# EasyEDA Pro project PicoMiteUSB.eprj, board PCB3
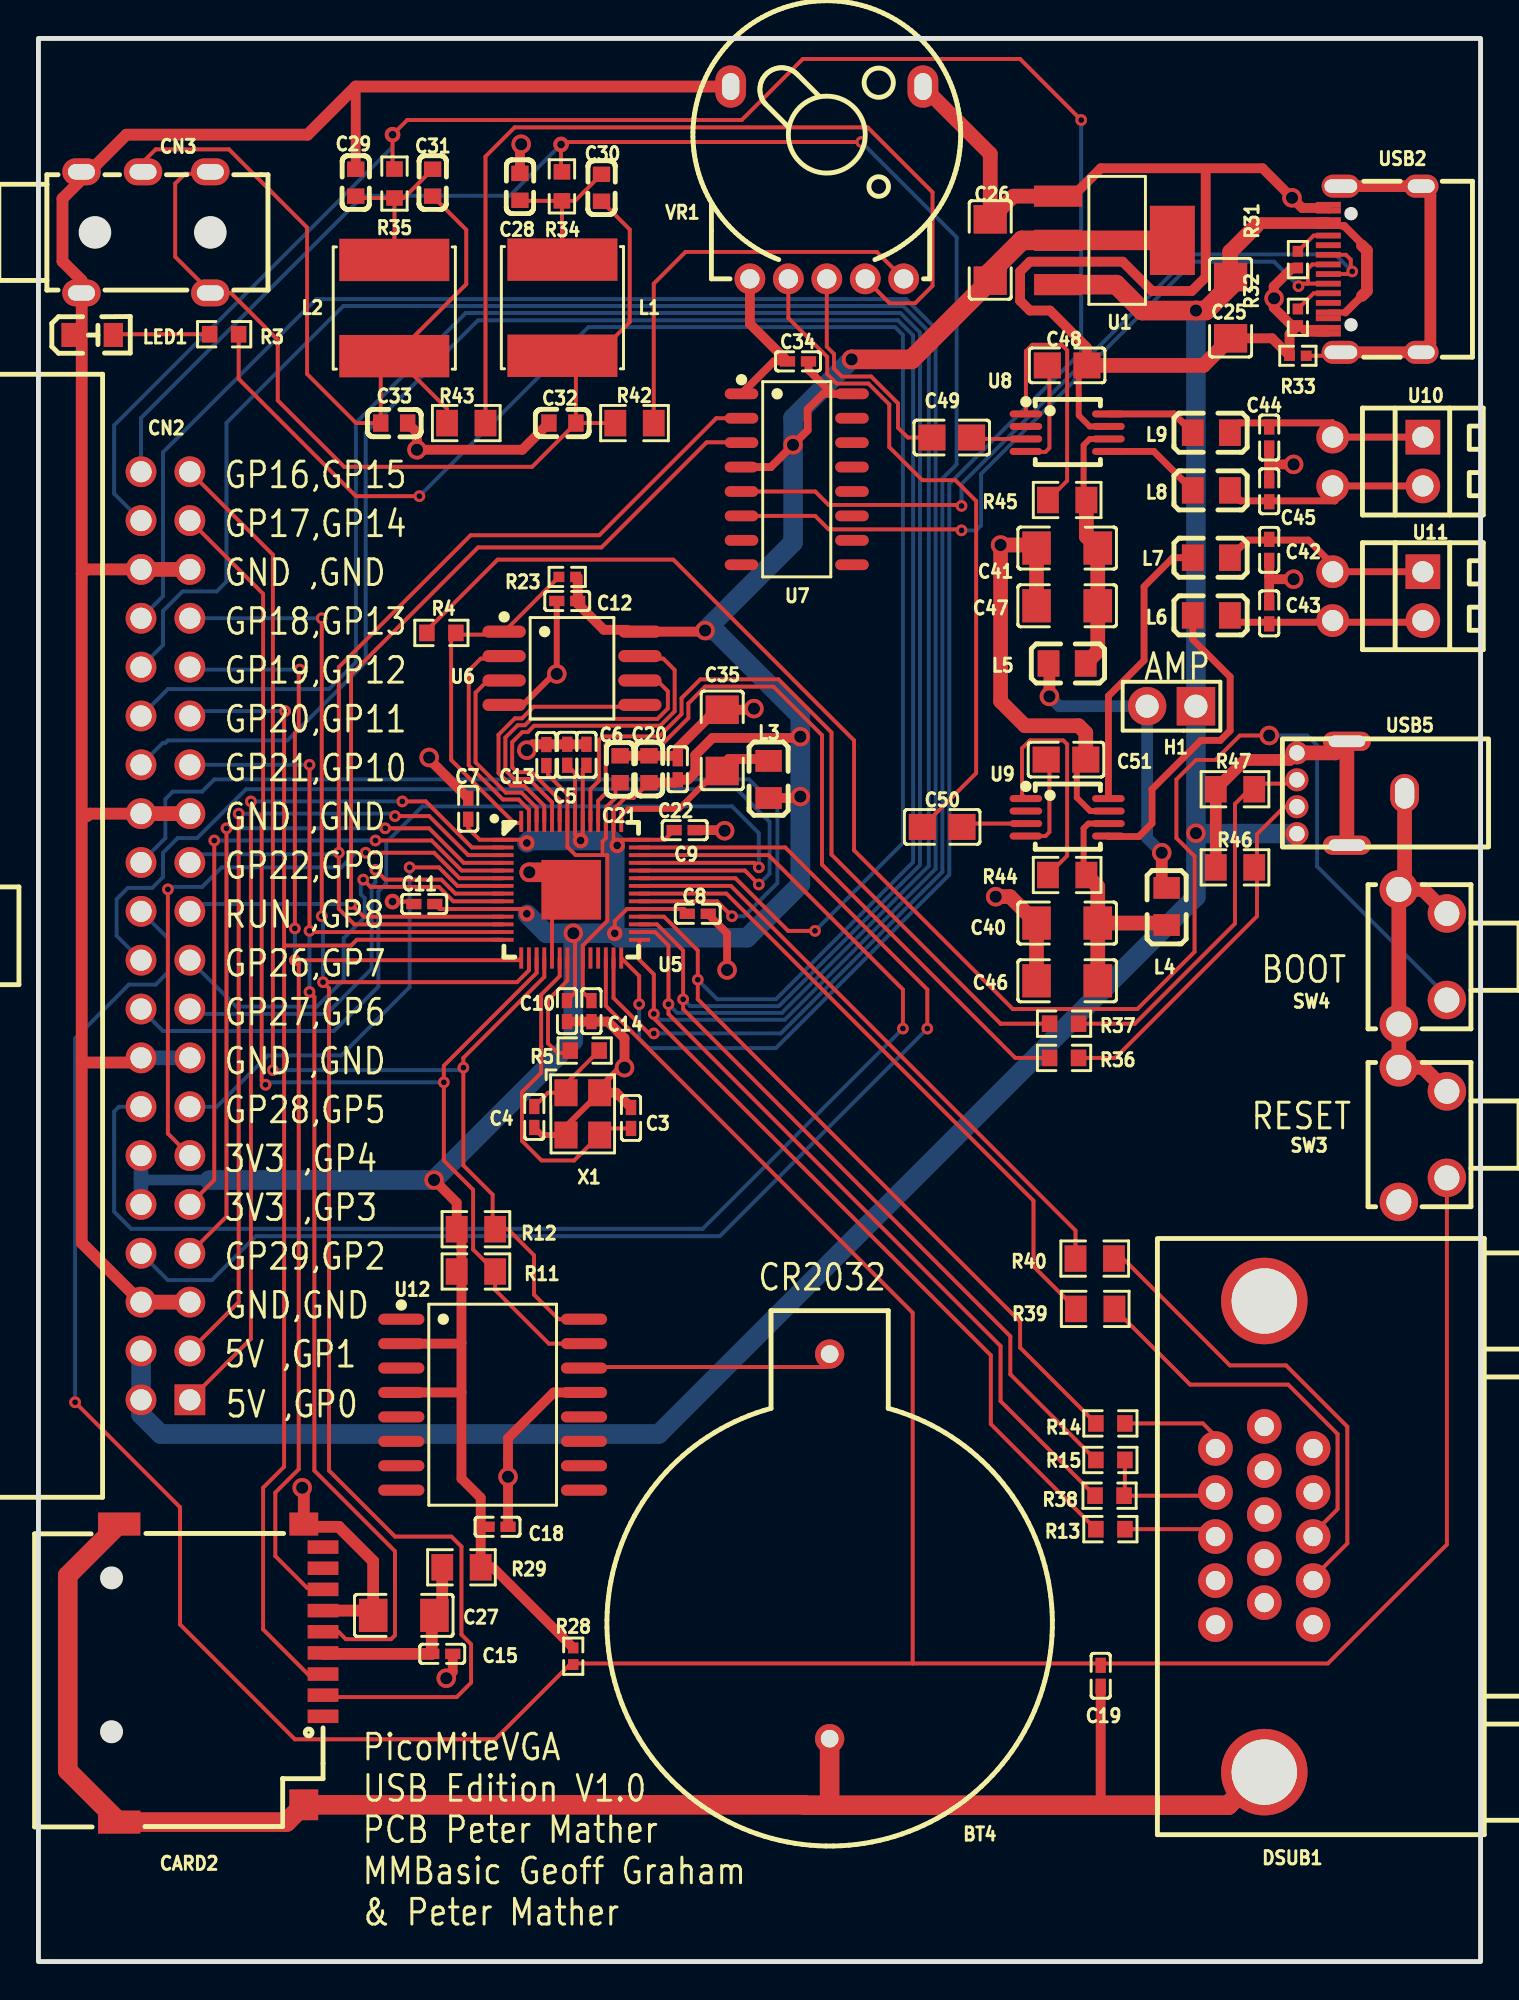
[diagram p1: board, top side]
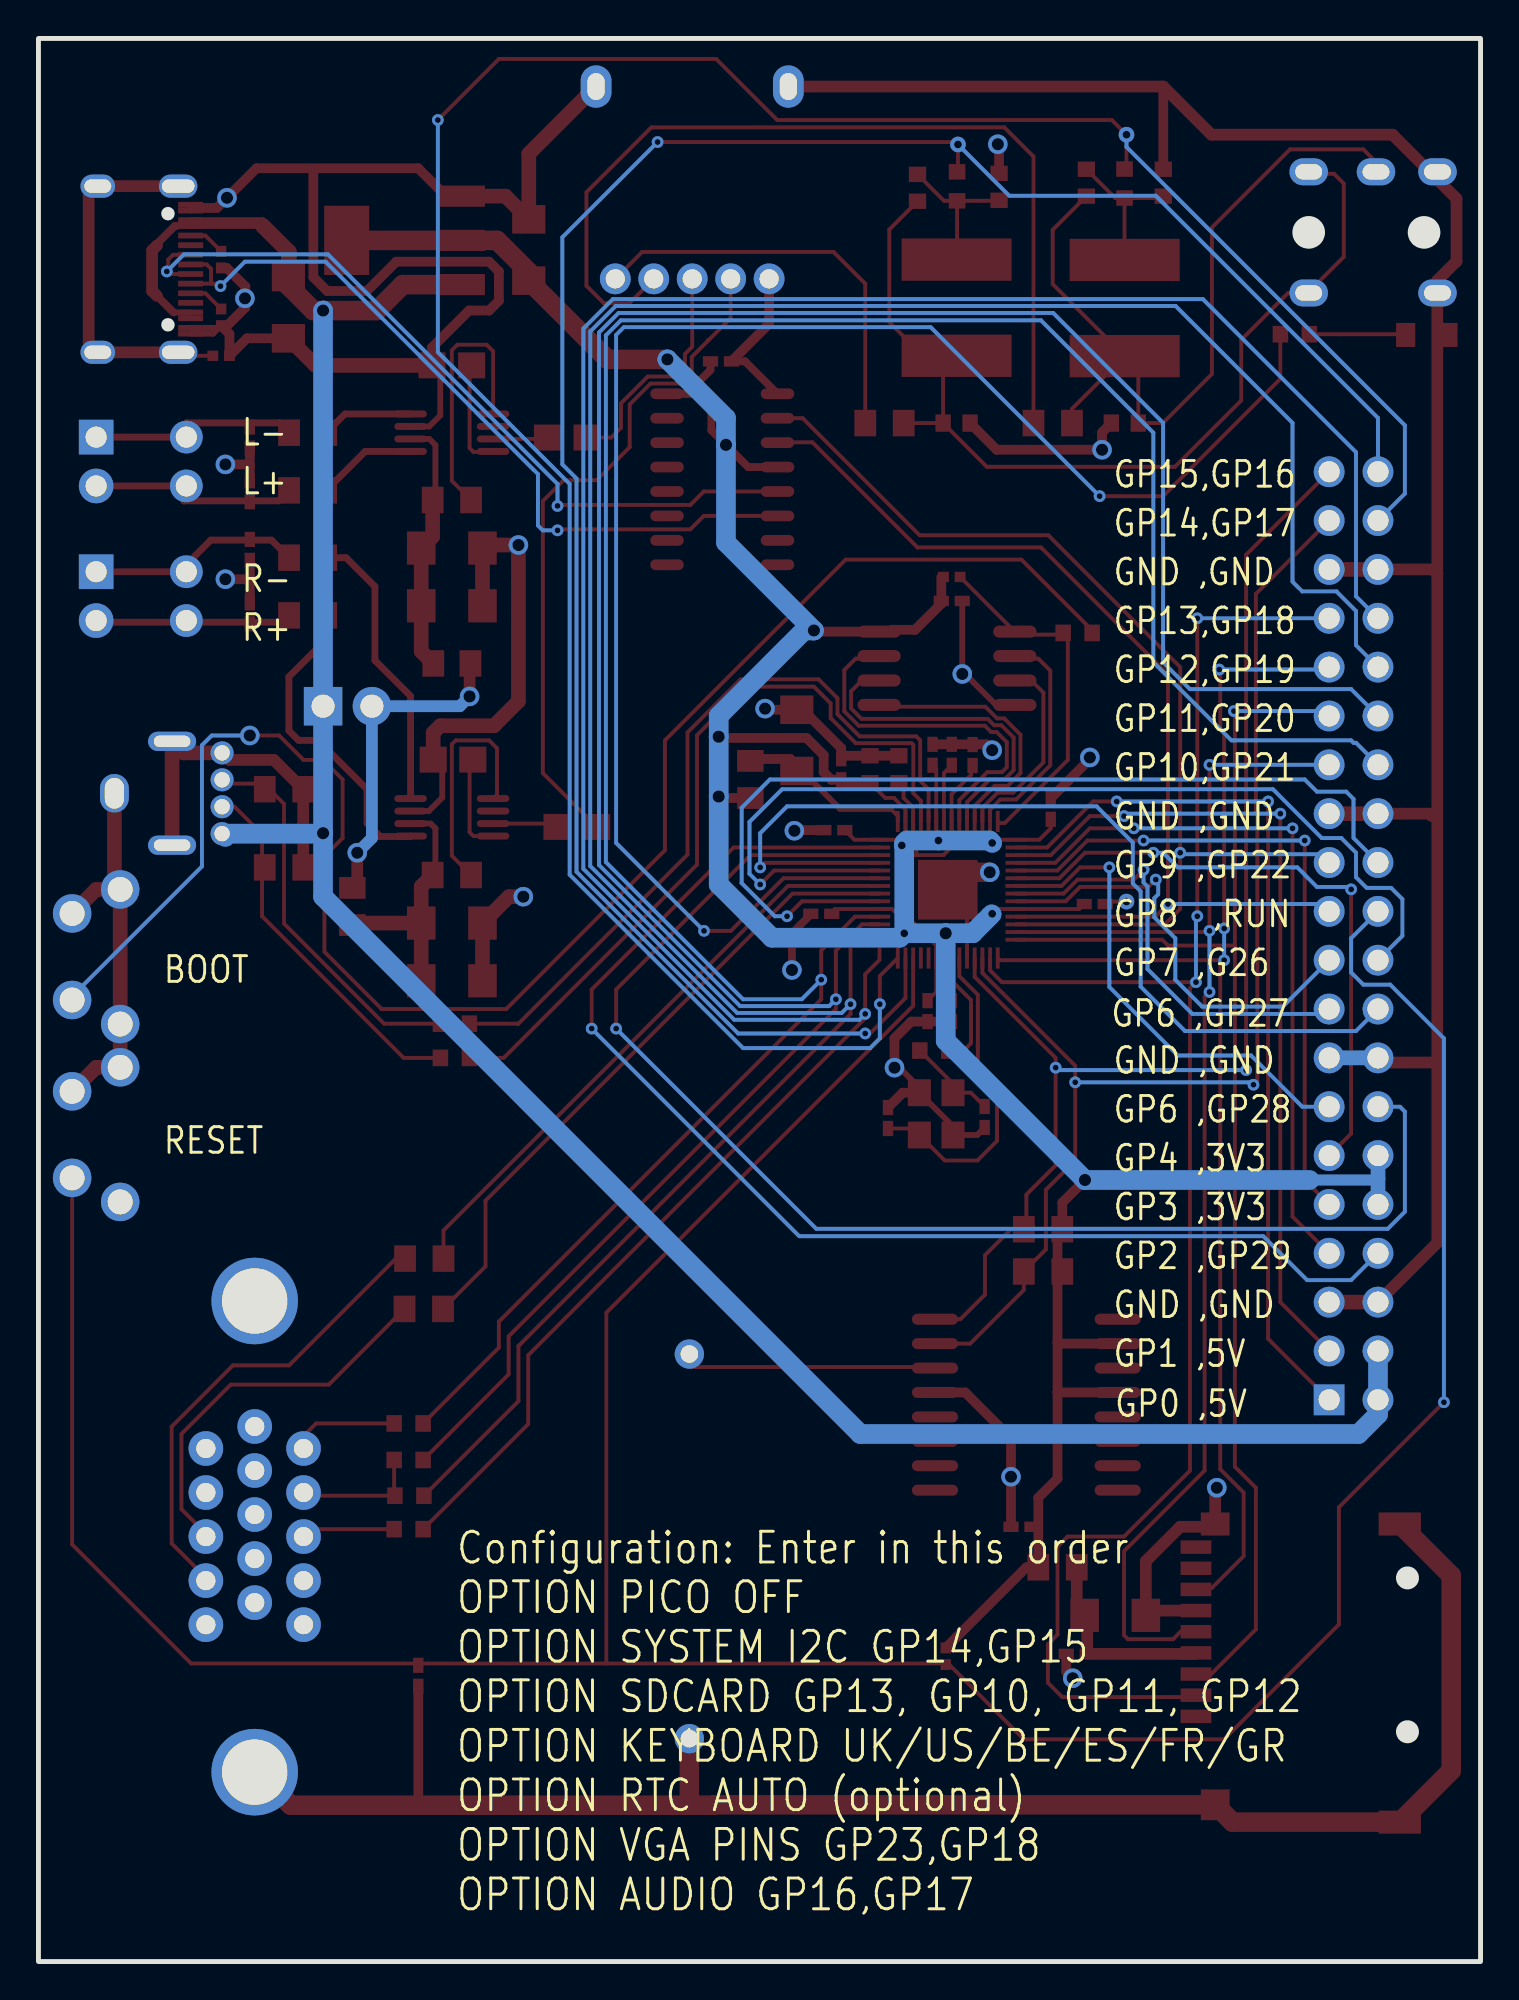
[diagram p2: board, bottom side, seen from below]

Outline 75 x 100 mm; copper layers: Top Layer, Bottom Layer. Coordinates in mm from the lower left corner of the outline.
Outline path: rectangle 75,0 0,100
Stack: Top Layer 0.035mm / Dielectric1 1.51mm FR4 er 4.5 / Bottom Layer 0.035mm

## Design rules (mm)
spacing safeClearance (default): track to track 0.152, other pairs 0.152 to 0.3
track width trackWidth (default): min 0.127, default 0.254, max 2.54
differential pair differentialPair (default): width min 0.127, default 0.254, max 2.54; gap min 0.152, default 0.152
via viaSize (default): diameter min 0.5, default 0.61, max 10; hole min 0.3, default 0.305, max 6

## Placement (name value [footprint] x y rotation side)
BT4  BS-04-A1BJ005  [BAT-TH_BS-04-A1BJ004]  41.15 21.59 90 top
C3  30pF  [C0402]  30.82 43.87 270 top
C4  30pF  [C0402]  25.79 43.92 90 top
C5  100nF  [C0402_NEW]  27.5 62.75 270 top
C6  100nF  [C0402_NEW]  28.5 62.75 270 top
C7  100nF  [C0402_NEW]  22.35 59.94 270 top
C8  100nF  [C0402_NEW]  34.29 54.48 180 top
C9  100nF  [C0402_NEW]  33.61 58.83 180 top
C10  100nF  [C0402_NEW]  27.49 49.42 90 top
C11  100nF  [C0402_NEW]  20.07 54.99 0 top
C12  100nF  [C0402_NEW]  27.5 70.75 0 top
C13  100nF  [C0402_NEW]  26.42 62.74 90 top
C14  100nF  [C0402_NEW]  28.76 49.42 270 top
C15  100nF  [C0402_NEW]  21 16 0 top
C18  100nF  [C0402_NEW]  23.88 22.61 180 top
C19  100nF  [C0402_NEW]  55.25 14.86 90 top
C20  2.2uF  [C0603]  31.75 62 270 top
C21  2.2uF  [C0603]  30.25 62 90 top
C22  100nF  [C0402_NEW]  33.25 62 270 top
C25  10uF  [C1206]  62 86 90 top
C26  10uF  [C1206]  49.5 89 270 top
C27  10uF  [C1206]  19 18 180 top
C28  33nF  [C0603]  25.04 92.28 270 top
C29  33nF  [C0603]  16.5 92.5 270 top
C30  2.7nF  [C0603]  29.28 92.23 270 top
C31  2.7nF  [C0603]  20.5 92.5 270 top
C32  68nF  [C0603]  27.25 80 0 top
C33  68nF  [C0603]  18.5 80 180 top
C34  100nF  [C0402_NEW]  39.5 83.21 180 top
C35  10uF  [C1206]  35.56 63.5 270 top
C40  10uF  [C1206]  53.5 54 180 top
C41  10uF  [C1206]  53.5 73.5 180 top
C42  220pF  [C0402]  64.01 73.41 90 top
C43  220pF  [C0402]  64.01 70.1 270 top
C44  220pF  [C0402]  64.01 79.25 90 top
C45  220pF  [C0402]  64.01 76.45 270 top
C46  1uF  [C1206]  53.5 51 0 top
C47  1uF  [C1206]  53.5 70.5 0 top
C48  100nF  [C0805]  53.5 83 180 top
C49  100nF  [C0805]  47.5 79.25 0 top
C50  100nF  [C0805]  47 59 0 top
C51  100nF  [C0805]  53.44 62.5 180 top
CARD2  TF PUSH  [TF-SMD_TF-PUSH]  9.5 15 270 top
CN2  X9555WR-2x20-6TV01  [CONN-TH_X9555WR-2X20-6TV01]  6.6 53.34 270 top
CN3  PJ-313 5JCJ  [AUDIO-TH_PJ-313_5JCJ]  5.59 89.92 0 top
DSUB1  D-DMRH15PF-E006  [DSUB-TH_15P-P2.29-H-F_DDMRH15PFE006]  63.75 22.1 90 top
H1  PZ254V-11-02P  [HDR-TH_2P-P2.54-V-M]  58.93 65.28 180 top
L1  4.7mH  [IND-SMD_L6.0-W6.0]  27.25 86 270 top
L2  4.7mH  [IND-SMD_L6.0-W6.0]  18.51 85.98 270 top
L3  BLM21AG102SN1D  [L0805]  37.97 61.47 270 top
L4  BLM21AG102SN1D  [L0805]  58.67 54.86 90 top
L5  BLM21AG102SN1D  [L0805]  53.5 67.5 180 top
L6  BLM21AG102SN1D  [L0805]  61 70 0 top
L7  BLM21AG102SN1D  [L0805]  61 73 0 top
L8  BLM21AG102SN1D  [L0805]  61 76.5 0 top
L9  BLM21AG102SN1D  [L0805]  61 79.5 0 top
LED1  NCD0805R1  [LED0805-RD]  2.79 84.58 0 top
NOREF  -  [Pad_e923]  67.31 72.27 0 top
NOREF#2  -  [Pad_e915]  67.31 76.73 0 top
NOREF#3  -  [Pad_e919]  67.31 69.73 0 top
NOREF#4  -  [Pad_e908]  67.31 79.27 0 top
R3  1kΩ  [R0603]  9.66 84.62 180 top
R4  1kΩ  [R0603]  20.96 69.09 180 top
R5  1kΩ  [R0603]  28.41 47.37 180 top
R11  10kΩ  [R0805]  22.75 35.88 180 top
R12  10kΩ  [R0805]  22.75 38.08 180 top
R13  270Ω  [R0603]  55.75 22.48 0 top
R14  270Ω  [R0603]  55.75 27.98 0 top
R15  390Ω  [R0603]  55.75 26.08 0 top
R23  10kΩ  [R0402]  27.5 72 0 top
R28  10kΩ  [R0402]  27.81 15.88 90 top
R29  2.2Ω  [R0805]  22 20.5 180 top
R31  5.1kΩ  [R0402]  65.5 88.5 90 top
R32  5.1kΩ  [R0402]  65.5 85.5 90 top
R33  1MΩ  [R0402]  65.5 83.5 0 top
R34  220Ω  [R0603]  27.22 92.31 270 top
R35  220Ω  [R0603]  18.52 92.46 270 top
R36  27Ω  [R0603]  53.34 46.99 180 top
R37  27Ω  [R0603]  53.34 48.77 180 top
R38  820Ω  [R0603]  55.71 24.22 0 top
R39  47Ω  [R0805]  54.96 33.94 0 top
R40  47Ω  [R0805]  54.93 36.55 0 top
R42  27kΩ  [R0805]  31 80 0 top
R43  27kΩ  [R0805]  22.25 80 0 top
R44  10kΩ  [R0805]  53.5 56.5 0 top
R45  10kΩ  [R0805]  53.5 76 0 top
R46  15kΩ  [R0805]  62.23 56.9 180 top
R47  15kΩ  [R0805]  62.23 60.96 180 top
SW3  TS665ZJ  [SW-TH_TS665ZJ]  72 43 90 top
SW4  TS665ZJ  [SW-TH_TS665ZJ]  72 52.25 90 top
U1  AMS1117-3.3  [SOT-223-3_L6.5-W3.4-P2.30-LS7.0-BR]  56 89.5 180 top
U5  RP2040  [LQFN-56_L7.0-W7.0-P0.4-EP]  27.71 55.73 0 top
U6  W25Q128JVSIQ  [SOIC-8_L5.3-W5.3-P1.27-LS8.0-BL]  27.75 67.25 270 top
U7  CH340C  [SOP-16_L10.0-W3.9-P1.27-LS6.0-BL]  39.44 77.08 270 top
U8  PAM8302AASCR  [MSOP-8_L3.0-W3.0-P0.65-LS5.0-BL]  53.5 79.5 270 top
U9  PAM8302AASCR  [MSOP-8_L3.0-W3.0-P0.65-LS5.0-BL]  53.5 59.5 270 top
U10  DB125-2.54-2P-GN-S  [CONN-TH_DB125-2.54-2P-GN]  72 78 270 top
U11  DB125-2.54-2P-GN-S  [CONN-TH_DB125-2.54-2P-GN]  72 71 270 top
U12  DS3231SN#T&amp;R  [SOIC-16_L10.3-W7.5-P1.27-LS10.3-BL]  23.62 28.96 270 top
USB2  KH-TYPE-C-16P  [USB-C-SMD_KH-TYPE-C-16P]  69.5 88 90 top
USB5  906-561A1024D10200  [USB-A-TH_C39450]  68.25 60.75 90 top
VR1  10kΩ  [RES-TH_RK10J12E002L]  41 92.5 0 top
X1  12MHz  [OSC-SMD_4P-L3.2-W2.5-BL]  28.31 44.08 270 top

## Footprints (pads in the part's own frame, mm; a bottom-side part is the same pattern mirrored in y, then rotated)
AUDIO-TH_PJ-313_5JCJ
  oval 2x1.4 hole 1.4x0.8: 1(-3.35,3.15) 1(-3.35,-3.15) 2(3.35,3.15) 2(3.35,-3.15) 3(-0.15,3.15)
BAT-TH_BS-04-A1BJ004
  round 1.524 hole 0.914: 1(10,0) 2(-10,0)
C0402
  rect 0.79x0.54 smd: 1(-0.545,0) 2(0.545,0)
C0402_NEW
  rect 0.79x0.54 smd: 1(-0.545,0) 2(0.545,0)
C0603
  rect 0.8x0.9 smd: 1(-0.7,0) 2(0.7,0)
C0805
  rect 1.41x1.35 smd: 1(-1.03,0) 2(1.03,0)
C1206
  rect 1.485x1.728 smd: 1(-1.593,0) 2(1.593,0)
CONN-TH_DB125-2.54-2P-GN
  rect 1.8x1.8 hole 1.1: 1(-1.27,0)
  round 1.8 hole 1.1: 2(1.27,0)
CONN-TH_X9555WR-2X20-6TV01
  rect 1.6x1.6 hole 1.1: 1(24.13,1.27)
  round 1.6 hole 1.1: 2(24.13,-1.27) 3(21.59,1.27) 4(21.59,-1.27) 5(19.05,1.27) 6(19.05,-1.27) 7(16.51,1.27) 8(16.51,-1.27) 9(13.97,1.27) 10(13.97,-1.27) 11(11.43,1.27) 12(11.43,-1.27) 13(8.89,1.27) 14(8.89,-1.27) 15(6.35,1.27) 16(6.35,-1.27) 17(3.81,1.27) 18(3.81,-1.27) 19(1.27,1.27) 20(1.27,-1.27) 21(-1.27,1.27) 22(-1.27,-1.27) 23(-3.81,1.27) 24(-3.81,-1.27) 25(-6.35,1.27) 26(-6.35,-1.27) 27(-8.89,1.27) 28(-8.89,-1.27) 29(-11.43,1.27) 30(-11.43,-1.27) 31(-13.97,1.27) 32(-13.97,-1.27) 33(-16.51,1.27) 34(-16.51,-1.27) 35(-19.05,1.27) 36(-19.05,-1.27) 37(-21.59,1.27) 38(-21.59,-1.27) 39(-24.13,1.27) 40(-24.13,-1.27)
DSUB-TH_15P-P2.29-H-F_DDMRH15PFE006
  round 1.8 hole 1: 1(4.58,2.54) 2(2.29,2.54) 3(0,2.54) 4(-2.29,2.54) 5(-4.58,2.54) 6(5.725,0) 7(3.435,0) 8(1.145,0) 9(-1.145,0) 10(-3.435,0) 11(4.58,-2.54) 12(2.29,-2.54) 13(0,-2.54) 14(-2.29,-2.54) 15(-4.58,-2.54)
  round 4.5 hole 3.4: 16(-12.25,0) 17(12.25,0)
HDR-TH_2P-P2.54-V-M
  rect 2x2 hole 1.2: 1(-1.27,0)
  round 2 hole 1.2: 2(1.27,0)
IND-SMD_L6.0-W6.0
  rect 2.2x5.72 smd: 1(-2.5,0) 2(2.5,0)
L0805
  rect 1.133x1.377 smd: 1(-0.966,0) 2(0.966,0)
LED0805-RD
  rect 1x1.25 smd: 1(-1.1,0) 2(1.1,0)
LQFN-56_L7.0-W7.0-P0.4-EP
  rect 1.1x0.2 smd: 1(-3.55,2.6) 2(-3.55,2.2) 3(-3.55,1.8) 4(-3.55,1.4) 5(-3.55,1) 6(-3.55,0.6) 7(-3.55,0.2) 8(-3.55,-0.2) 9(-3.55,-0.6) 10(-3.55,-1) 11(-3.55,-1.4) 12(-3.55,-1.8) 13(-3.55,-2.2) 14(-3.55,-2.6) 29(3.55,-2.6) 30(3.55,-2.2) 31(3.55,-1.8) 32(3.55,-1.4) 33(3.55,-1) 34(3.55,-0.6) 35(3.55,-0.2) 36(3.55,0.2) 37(3.55,0.6) 38(3.55,1) 39(3.55,1.4) 40(3.55,1.8) 41(3.55,2.2) 42(3.55,2.6)
  rect 0.2x1.1 smd: 15(-2.6,-3.55) 16(-2.2,-3.55) 17(-1.8,-3.55) 18(-1.4,-3.55) 19(-1,-3.55) 20(-0.6,-3.55) 21(-0.2,-3.55) 22(0.2,-3.55) 23(0.6,-3.55) 24(1,-3.55) 25(1.4,-3.55) 26(1.8,-3.55) 27(2.2,-3.55) 28(2.6,-3.55) 43(2.6,3.55) 44(2.2,3.55) 45(1.8,3.55) 46(1.4,3.55) 47(1,3.55) 48(0.6,3.55) 49(0.2,3.55) 50(-0.2,3.55) 51(-0.6,3.55) 52(-1,3.55) 53(-1.4,3.55) 54(-1.8,3.55) 55(-2.2,3.55) 56(-2.6,3.55)
  rect 3.1x3.1 smd: 57(0,0)
MSOP-8_L3.0-W3.0-P0.65-LS5.0-BL
  oval 0.364x1.692 smd: 1(-0.975,-2.146) 2(-0.325,-2.146) 3(0.325,-2.146) 4(0.975,-2.146) 5(0.975,2.146) 6(0.325,2.146) 7(-0.325,2.146) 8(-0.975,2.146)
OSC-SMD_4P-L3.2-W2.5-BL
  rect 1.4x1.2 smd: 1(-1.1,-0.875) 2(1.1,-0.875) 3(1.1,0.875) 4(-1.1,0.875)
Pad_e908
  round 1.7 hole 1.1: 58(0,0)
Pad_e915
  round 1.7 hole 1.1: 59(0,0)
Pad_e919
  round 1.7 hole 1.1: 61(0,0)
Pad_e923
  round 1.7 hole 1.1: 60(0,0)
R0402
  rect 0.566x0.54 smd: 1(-0.433,0) 2(0.433,0)
R0603
  rect 0.806x0.864 smd: 1(-0.753,0) 2(0.753,0)
R0805
  rect 1.133x1.377 smd: 1(-1,0) 2(1,0)
RES-TH_RK10J12E002L
  round 1.6 hole 1: 1(-4,-5) 2(0,-5) 3(2,-5) 4(-2,-5) 5(4,-5)
  oval 1.6x2.2 hole 0.9x1.4: 6(5,5) 7(-5,5)
SOIC-8_L5.3-W5.3-P1.27-LS8.0-BL
  oval 0.63x2.25 smd: 1(-1.905,-3.53) 2(-0.635,-3.53) 3(0.635,-3.53) 4(1.905,-3.53) 5(1.905,3.53) 6(0.635,3.53) 7(-0.635,3.53) 8(-1.905,3.53)
SOIC-16_L10.3-W7.5-P1.27-LS10.3-BL
  oval 0.574x2.401 smd: 1(-4.445,-4.75) 2(-3.175,-4.75) 3(-1.905,-4.75) 4(-0.635,-4.75) 5(0.635,-4.75) 6(1.905,-4.75) 7(3.175,-4.75) 8(4.445,-4.75) 9(4.445,4.75) 10(3.175,4.75) 11(1.905,4.75) 12(0.635,4.75) 13(-0.635,4.75) 14(-1.905,4.75) 15(-3.175,4.75) 16(-4.445,4.75)
SOP-16_L10.0-W3.9-P1.27-LS6.0-BL
  oval 0.56x1.745 smd: 1(-4.445,-2.873) 2(-3.175,-2.873) 3(-1.905,-2.873) 4(-0.635,-2.873) 5(0.635,-2.873) 6(1.905,-2.873) 7(3.175,-2.873) 8(4.445,-2.873) 9(4.445,2.873) 10(3.175,2.873) 11(1.905,2.873) 12(0.635,2.873) 13(-0.635,2.873) 14(-1.905,2.873) 15(-3.175,2.873) 16(-4.445,2.873)
SOT-223-3_L6.5-W3.4-P2.30-LS7.0-BR
  rect 2.5x1.1 smd: 1(2.97,-2.3) 2(2.97,0) 3(2.97,2.3)
  rect 2.34x3.6 smd: 4(-2.97,0)
SW-TH_TS665ZJ
  round 2 hole 1.3: 1(-2.25,-1.25) 2(2.25,-1.25) 3(-3.5,1.25) 4(3.5,1.25)
TF-SMD_TF-PUSH
  rect 0.7x1.6 smd: 1(2.25,5.3) 2(1.15,5.3) 3(0.05,5.3) 4(-1.05,5.3) 5(-2.15,5.3) 6(-3.25,5.3) 7(-4.35,5.3) 8(-5.45,5.3) CD(-6.55,5.3)
  rect 1.2x1.5 smd: 10(-7.75,4.3)
  rect 1.2x2.2 smd: 11(-7.75,-5.3) 12(7.75,-5.3)
  rect 1.6x1.5 smd: 13(6.85,4.3)
USB-A-TH_C39450
  round 1.2 hole 0.8: 1(-2.1,2.8) 2(-0.7,2.8) 3(0.7,2.8) 4(2.1,2.8)
  oval 1x2.5 hole 0.6x1.9: 5(2.7,0.2) 6(-2.7,0.2)
  oval 2x1.5 hole 1.6x1: 7(0,-2.8)
USB-C-SMD_KH-TYPE-C-16P
  oval 1.2x2 hole 0.7x1.7: 1(-4.32,1.765) 2(4.32,1.765)
  oval 1.2x1.8 hole 0.7x1.4: 3(-4.32,-2.415) 4(4.32,-2.415)
  rect 0.3x1.3 smd: A1(-3.35,2.415) A4(-2.55,2.415) A5(-1.25,2.415) A6(-0.25,2.415) A7(0.25,2.415) A8(1.25,2.415) A9(2.55,2.415) A12(3.35,2.415) B1(3.05,2.415) B4(2.25,2.415) B5(1.75,2.415) B6(0.75,2.415) B7(-0.75,2.415) B8(-1.75,2.415) B9(-2.25,2.415) B12(-3.05,2.415)

## Nets
As in the schematic, except:
$1N161504: C42.2 L7.2 NOREF.60 U11.1
$1N161517: C43.2 L6.2 NOREF#3.61 U11.2
$1N161532: C44.2 L9.2 NOREF#4.58 U10.1
$1N161537: C45.2 L8.2 NOREF#2.59 U10.2

Pads without a net: CARD2 1 8 CD; DSUB1 4 9 11 12 15; U5 24 25; U7 7 8 9 10 11 12 13 14 15; U8 2; U9 2; U12 1 3 5 6 7 8 9 10 11 12; USB2 A8 B8

## Via types
v1: diameter 1.016, hole 0.635, Top Layer to Bottom Layer, 31 vias
v2: diameter 0.813, hole 0.406, Top Layer to Bottom Layer, 8 vias
v3: diameter 0.61, hole 0.305, Top Layer to Bottom Layer, 49 vias

## Routing (per net, layer and track width the routed paths; a pad name or vN(x,y) marks a point on that pad's centre or on a via; arc(x,y) is an arc through that point)
1V1: length 19.4
  Top Layer w0.203: 29.34,57.54 29.34,58.25 29.51,58.42 ; 29.34,57.54 27.93,57.54 27.51,57.96 U5.50 27.51,60.7 26.5,61.71 26.5,62.2 ; 29.34,57.54 29.58,57.54 29.59,57.52 29.59,54.12 28.31,52.83 U5.23 28.31,50.42 C14.1 ; 29.51,58.42 U5.45 29.51,60.01 30.01,60.51 30.01,61.43 ; 29.51,58.42 29.51,58.42
+5V: length 134.9
  Top Layer w0.305: USB2.A9 63.33,90.55 63.33,90.25 USB2.B4 67.82,90.25 ; 67.97,85.75 USB2.B9
  Top Layer w0.406: 67.82,90.25 67.91,90.25 68.83,89.32 68.83,89.23 ; 68.83,86.61 67.97,85.75
  Top Layer w0.61: 68.83,86.61 69.09,86.87 69.09,88.98 68.83,89.23
  Top Layer w0.813: 63.33,90.25 61.98,88.9 61.98,87.62 C25.2
  Top Layer w1.016: U1.3 56.05,87.2 57.4,85.85 v1(60.2,85.85) 60.71,85.85 62,87.15 C25.2
  Bottom Layer w1.016: v1(60.2,85.85) H1.1 v1(60.2,58.67) ; v1(60.2,58.67) 60.2,55.37 32.26,27.43 6.35,27.43 5.33,28.45 CN2.2 CN2.4 ; v1(60.2,58.67) 60.22,58.65 USB5.1 65.28,58.48
AVDD: length 9.5
  Top Layer w0.203: 35,61.63 35,61.91 ; U5.43 30.31,59.57 30.68,59.94
  Top Layer w0.305: 30.68,59.94 30.69,59.93 33.31,59.93 35,61.63
  Top Layer w0.508: 35,61.63 35.91,62.53 38,62.53
GND: length 446.9
  Top Layer w0.203: 27.6,55.63 26.71,54.73 U5.19 ; 20.32,62.52 v1(20.32,62.61) ; v2(18.41,55.12) 19.39,55.12 19.52,54.99 ; v1(37.21,65.15) 37.15,65.09
  Top Layer w0.305: 54.04,62.5 54,62.45 54,60.52 54.7,59.83 U9.7 ; X1.4 27.44,43.43 X1.2 26.18,42.98 C4.1 ; 65.62,84.95 R32.1 ; 65.62,84.95 USB2.B12 ; 65.62,84.95 65.92,84.65 USB2.A1 ; 53.8,91.8 U1.1 ; USB2.B1 66.95,91.19 ; 26.96,70.5 v1(26.96,66.95) 26.81,66.95 25.15,65.3 24.72,65.3 ; U8.7 54.68,79.83 54.1,80.4 54.1,82.94 54.04,83 ; v1(30.48,46.48) 30.22,46.48 29.17,45.43
  Top Layer w0.406: U7.1 38.25,83.21 38.96,83.21 ; 34.91,54.37 35.81,53.47 v1(35.81,51.56)
  Top Layer w0.508: C15.2 21.54,15.07 v1(21.21,14.73) ; C48.1 54.53,83.93 52.61,85.85 51.56,85.85 51.05,86.36 51.05,87.88 51.56,88.39 56.39,88.39 57.91,86.87 59.98,86.87 60.71,87.59 60.71,93.2 ; v1(35.69,58.8) 35.66,58.83 C9.1 ; 64.01,77.82 64.04,77.85 v1(65.28,77.85) ; 64.01,77.82 C44.1 ; 64.01,77.82 C45.1 ; C25.1 64.16,84.41 R33.1 65.07,84.63 R32.1 65.18,85.07 64.24,86.01 64.24,87.1 65.21,88.07 R31.1 ; 64.01,72.02 C43.1 ; 64.01,72.02 64.14,71.88 v1(65.28,71.88) ; 64.01,72.02 C42.1 ; v1(25.1,94.5) 25.04,94.44 C28.1 ; C18.1 v1(24.42,25.21) 24.42,27.22 26.8,29.59 28.37,29.59 ; v1(25.4,62.99) 25.7,63.3 C5.1 C6.1 ; C10.1 C14.2 29.61,48.88 30.48,48.01 v1(30.48,46.48) ; C3.1 30.05,45.18 X1.4 ; 55.34,8.13 55.25,8.22 C19.1 ; 37.15,65.09 C35.1 35.25,65.09 33.25,63.09 C22.1 33.09,62.7 C20.1 C21.2 ; C7.1 20.32,62.52 ; VR1.1 37,85.17 38.96,83.21 ; 66.95,91.19 65.72,91.19 v1(65.19,91.71) 63.66,93.25 55.25,93.25 53.8,91.8 ; C32.1 25.16,78.61 v1(19.69,78.61) 19.69,79.52 C33.1 ; C29.1 16.5,97.5
  Top Layer w0.61: 2.25,46.75 5.09,46.75 CN2.16 ; 2.25,46.75 2.25,37.37 CN2.6 ; 2.25,46.75 2.25,72.16 ; 2.25,72.16 2.25,87.41 1.25,88.41 1.25,91.67 2.24,92.66 2.24,92.96 2.54,92.96 4.57,95 14,95 16.5,97.5 VR1.7 ; 2.25,72.16 2.48,72.39 CN2.36 ; v1(13.72,24.64) 13.8,24.55 CARD2.10 13.94,22.61 15.62,22.61 17.41,20.82 C27.2 17.16,18.25 CARD2.6 ; CN2.26 2.67,59.69 2.54,59.56 ; USB5.4 65.08,62.48 62.75,62.48 R47.2 R46.2
  Top Layer w0.762: v1(49.78,55.37) 50.54,55.37 C40.2 C46.1 ; CN2.26 CN2.25 ; VR1.6 49.5,94 C26.1 50.71,91.8 U1.1 ; SW3.2 72,46.5 SW3.4 SW4.3 SW4.4 ; USB5.7 71.05,56.05 SW4.4 ; SW4.4 72,55.75 SW4.2 ; C25.1 60.59,83 C48.1 ; C47.1 C41.2 51.75,73.66 v1(50.04,73.66) 50.04,65.53 51.31,64.26 54.1,64.26 54.47,63.89 C51.1 ; USB5.4 67.45,62.85 USB5.5 USB5.6 ; CN2.6 CN2.5 ; CN2.36 CN2.35
  Top Layer w1.016: 64,10.25 61.88,8.13 41.15,8.13 ; CARD2.11 1.52,20.07 1.52,9.93 CARD2.12 12.9,7.25 CARD2.13 39.86,8.15 39.88,8.13 41.15,8.13 ; 41.15,8.13 BT4.2 ; U5.57 27.6,55.63 26.59,56.64 v1(25.53,56.64)
  Bottom Layer w0.762: CN2.16 CN2.15
  vias: v1(64.26,86.49)
VCC: length 208.1
  Top Layer w0.203: 33.83,54.48 33.58,54.73 U5.33 30.6,54.73 29.97,54.1 v2(29.97,53.47) ; v2(25.4,54.48) 25.15,54.73 U5.10 20.87,54.73 C11.2 ; C5.2 27.91,61.8 U5.49 27.91,58.58 v2(28.19,58.29) 28.31,58.41 U5.48 28.31,62.01 C6.2 ; C10.2 27.91,50.39 U5.22 27.91,53.38 v1(27.82,53.47) ; 22,35.63 R11.2 ; v2(25.4,58.17) 25.23,58.33 U5.1 22.95,58.33 22.35,58.93 C7.2 ; 28.04,70.61 27.93,70.5 ; C20.2 30.96,60.51 30.5,60.51 30.5,60.5 29.91,59.91 U5.44 29.91,58.23 v2(30.1,58.04) 30.39,58.33 U5.42 32.56,58.33 C9.2
  Top Layer w0.305: 22,37.83 R12.2
  Top Layer w0.406: U7.16 41.29,81.52 ; 41.29,81.52 40.05,82.76 C34.1 ; 41.29,81.52 40.82,81.52 40,80.71 40,79.63 v1(39.24,78.87) 38.09,77.71 U7.4
  Top Layer w0.508: 22,37.83 22,32.18 ; 18.87,29.59 18.87,29.59 22,29.59 ; R12.2 21.75,39.46 v1(20.57,40.64) ; v1(34.67,69.22) 34.61,69.16 U6.8 ; L3.2 39.55,60.5 v1(39.62,60.58) ; 22,32.18 21.95,32.13 18.87,32.13 ; 22,32.18 22,29.59 ; 28.04,72 28.04,70.61 29.41,69.25 30.63,69.25 ; C20.2 33.09,61.3 C22.2 33.77,61.45 34.16,61.85 34.16,62.74 35.05,63.63 39.62,63.63 ; 22,29.59 22,25.12 23,24.12 R29.1 23.62,20.5 R28.2
  Top Layer w1.016: U1.4 U1.2 51.15,89.5 49.5,87.85 C26.2 45.4,83.31 v1(42.29,83.31)
  Bottom Layer w0.559: 8.89,40.64 5.42,40.64
  Bottom Layer w0.61: 5.42,40.64 5.33,40.73
  Bottom Layer w0.762: CN2.10 CN2.12
  Bottom Layer w1.016: v2(25.4,58.17) 25.53,58.29 v2(28.19,58.29) 29.84,58.29 29.97,58.17 v2(29.97,53.47) ; v1(42.29,83.31) 39.24,80.26 v1(39.24,78.87) 39.24,73.79 v1(34.67,69.22) 35.18,69.22 39.62,64.77 v1(39.62,63.69) v1(39.62,60.58) 39.62,56.01 36.86,53.24 30.2,53.24 v2(29.97,53.47) ; v1(27.82,53.47) 29.97,53.47 v2(29.97,53.47) ; v1(27.82,53.47) 26.41,53.47 25.43,54.46 ; v1(27.82,53.47) 27.82,47.88 v1(20.57,40.64) 8.89,40.64
AMP_PWR: length 16.9
  Top Layer w0.61: v1(58.42,57.66) 58.42,56.08 L4.2 ; v1(52.58,65.79) 52.58,67.46 L5.2
  Bottom Layer w0.61: v1(58.42,57.66) 57.66,58.42 H1.2 53.09,65.28 v1(52.58,65.79)
GP0: length 46.5
  Top Layer w0.203: U5.2 22.54,57.93 20.15,60.33 v3(18.92,60.33) ; v3(11.05,60.33) 11.05,32.39 CN2.1
  Bottom Layer w0.203: v3(18.92,60.33) v3(11.05,60.33)
GP1: length 43.6
  Top Layer w0.203: CN2.3 10.41,34.29 v3(10.41,59.69) ; U5.3 22.35,57.53 20.32,59.56 v3(18.54,59.56)
  Bottom Layer w0.203: v3(18.54,59.56) 18.41,59.69 v3(10.41,59.69)
GP2: length 38
  Top Layer w0.203: v3(18.03,58.93) 20.32,58.93 22.12,57.13 U5.4 ; v3(9.78,58.93) 9.78,38.73 CN2.7
  Bottom Layer w0.203: v3(18.03,58.93) v3(9.78,58.93)
GP3: length 35.1
  Top Layer w0.203: CN2.9 9.14,40.64 v3(9.14,58.29) ; U5.5 22.01,56.73 20.45,58.29 v3(17.53,58.29)
  Bottom Layer w0.203: v3(17.53,58.29) v3(9.14,58.29)
GP4: length 33.1
  Top Layer w0.203: U5.6 21.9,56.33 20.57,57.66 v3(17.02,57.66) ; v3(6.73,55.75) 6.73,43.05 CN2.11
  Bottom Layer w0.203: v3(6.73,55.75) 6.86,55.88 8.51,55.88 9.53,56.9 15.75,56.9 16.51,57.66 v3(17.02,57.66)
GP5: length 25.5
  Top Layer w0.203: v3(19.3,56.9) 20.83,56.9 21.79,55.93 U5.7
  Bottom Layer w0.203: CN2.13 9.27,44.45 11.94,47.12 15.75,47.12 19.3,50.67 v3(19.3,56.9)
GP6: length 22.9
  Top Layer w0.203: v3(17.53,56.77) 18.03,56.26 20.96,56.26 21.68,55.53 U5.8
  Bottom Layer w0.203: v3(17.53,56.77) 17.53,56.11 17.32,55.91 17.32,51.61 14.99,49.28 8.13,49.28 CN2.17
GP7: length 23.1
  Top Layer w0.203: U5.9 21.58,55.13 20.83,55.88 17.27,55.88 v3(16.89,56.26)
  Bottom Layer w0.203: v3(16.89,56.26) 16.76,56.13 16.76,55.5 16.97,55.3 16.97,54.31 15.88,53.21 15.88,51.06 15.88,51.06 14.48,49.66 10.29,49.66 CN2.19
GP8: length 54
  Top Layer w0.203: U5.11 16.91,54.33 v3(16.26,54.99) 16.26,66.93 22.86,73.53 29.28,73.53 34.75,79 36.55,79 U7.3
  Bottom Layer w0.203: v3(16.26,54.99) 8.25,54.99 CN2.21
GP9: length 55.7
  Top Layer w0.203: U5.12 16.43,53.93 15.62,54.74 v3(15.62,57.66) 15.62,67.31 22.48,74.17 29.17,74.17 35.25,80.25 U7.2
  Bottom Layer w0.203: CN2.23 8.31,57.58 15.55,57.58 v3(15.62,57.66)
GP10: length 67.4
  Top Layer w0.203: v3(14.1,50.42) 14.35,50.17 14.35,25.53 18.54,21.34 18.54,16.97 18.34,16.76 15.99,16.76 15.6,17.15 CARD2.5 ; U5.13 14.16,53.53 v3(14.1,53.59) v3(14.1,62.23)
  Bottom Layer w0.203: v3(14.1,50.42) v3(14.1,53.59) ; v3(14.1,62.23) CN2.27
GP11: length 68.9
  Top Layer w0.203: 12.78,52.83 16.26,52.83 16.56,53.13 U5.14 ; 12.78,52.83 12.78,25.73 11.68,24.64 11.68,17.27 14.1,14.86 14.71,14.86 CARD2.3 ; 12.78,52.83 12.78,64.97 v3(12.83,65.02)
  Bottom Layer w0.203: v3(12.83,65.02) 8.13,65.02 CN2.29
GP12: length 67.6
  Top Layer w0.203: CARD2.7 14.72,19.43 13.97,19.43 12.32,21.08 12.32,24.38 13.54,25.6 13.54,51.87 v3(13.33,52.07) 25,52.07 U5.15 ; v3(13.33,53.72) 13.33,63.88 13.54,64.08 13.54,67.13 v3(13.59,67.18)
  Bottom Layer w0.203: v3(13.33,52.07) v3(13.33,53.72) ; v3(13.59,67.18) 8,67.18 CN2.31
GP13: length 86.8
  Top Layer w0.203: U5.16 25.51,51.54 24.89,50.93 v3(14.8,50.93) 15.11,50.61 15.11,25.53 18.54,22.1 21.48,22.1 22,21.58 22,17 22.5,16.5 22.5,14.5 21.75,13.75 14.9,13.75 CARD2.2 ; v3(14.73,54.36) v3(14.73,69.85)
  Bottom Layer w0.203: v3(14.73,69.85) CN2.33 ; v3(14.8,50.93) 14.8,54.29 v3(14.73,54.36)
GP14: length 66.5
  Top Layer w0.203: CN2.37 11.68,71.12 11.68,59.69 11.61,59.61 11.61,45.8 v3(11.81,45.59) ; U5.17 25.91,51.41 21.08,46.58 v3(21.08,45.72) 21.08,41.66 22.61,40.13 22.61,37.03 R11.1 23.75,34.92 26.54,32.13 28.37,32.13
  Bottom Layer w0.203: v3(21.08,45.72) 11.9,45.72 11.78,45.59
GP15: length 67.2
  Top Layer w0.203: CN2.39 12.19,73.15 v3(12.19,46.36) ; U12.16 27.05,33.4 25.77,34.68 25.77,36.73 24.42,38.08 R12.1 23.62,38.21 23.62,39.88 22.1,41.4 v3(22.1,46.48) 22.1,46.99 26.31,51.2 U5.18
  Bottom Layer w0.203: v3(22.1,46.48) 21.97,46.36 v3(12.19,46.36)
GP16: length 111.4
  Top Layer w0.203: v3(32,48.26) 31.75,48.26 29.91,50.1 U5.27 ; R34.1 27.18,93.11 v2(27.18,94.49) 27.31,94.61 v3(42.8,94.61)
  Bottom Layer w0.203: CN2.40 5.33,80.26 16.89,91.82 24.51,91.82 v2(27.18,94.49) ; v3(32,48.26) 38.61,48.26 47.02,56.67 47.02,77.11 47.75,77.85 47.75,89.66 v3(42.8,94.61)
GP17: length 134
  Top Layer w0.203: v3(31.24,49.78) 31.24,51.25 U5.28 ; v3(54.23,95.76) 51.05,98.93 39.75,98.93 36.58,95.76 19.18,95.76 v2(18.41,95) 18.41,93.31 R35.1
  Bottom Layer w0.203: CN2.38 3.94,76.33 3.94,79.88 18.41,94.36 v2(18.41,95) ; v3(54.23,95.76) 54.23,83.69 47.37,76.83 47.37,56.52 38.35,47.5 31.75,47.5 31.24,48.01 v3(31.24,49.78)
GP18: length 139.8
  Top Layer w0.203: U5.29 31.26,52.08 32,51.34 v3(32,49.28) 32,49.05 49.53,31.52 49.53,27.95 R13.1
  Bottom Layer w0.203: CN2.34 6.48,70.99 6.48,78.49 14.44,86.45 45.13,86.45 46.66,84.91 46.66,56.82 38.81,48.97 32.31,48.97 v3(32,49.28)
GP19: length 139.5
  Top Layer w0.203: U5.30 32.07,53.53 32.77,52.83 v3(32.77,49.78) 32.77,49.28 50.04,32 50.04,29.14 R38.1
  Bottom Layer w0.203: CN2.32 6.48,68.45 6.48,70.23 7.49,71.25 9.27,71.25 9.78,71.75 9.78,80.01 15.86,86.09 44.97,86.09 46.3,84.76 46.3,56.97 38.66,49.33 33.22,49.33 v3(32.77,49.78)
GP20: length 138.3
  Top Layer w0.203: U5.31 32.17,53.93 33.53,52.57 v3(33.53,50.04) 33.53,49.53 50.55,32.51 50.55,30.53 R15.1
  Bottom Layer w0.203: v3(33.53,50.04) 33.88,49.68 38.51,49.68 45.85,57.02 45.85,84.71 44.83,85.72 22.22,85.72 16.51,80.01 16.51,67.56 15.11,66.17 6.73,66.17 CN2.30
GP21: length 135.9
  Top Layer w0.203: R14.1 51.05,31.92 51.05,33.27 34.29,50.04 v3(34.29,51.05) 34.29,52.58 32.54,54.33 U5.32
  Bottom Layer w0.203: CN2.28 6.48,63.37 6.6,63.37 6.73,63.5 12.95,63.5 17.02,67.56 17.02,79.5 22.86,85.34 44.71,85.34 45.49,84.56 45.49,57.18 38.35,50.04 35.31,50.04 v3(34.29,51.05)
GP22: length 48.8
  Top Layer w0.203: U5.34 35.29,55.13 v3(36.07,54.36)
  Bottom Layer w0.203: v3(36.07,54.36) 36.7,54.36 38.43,56.08 38.43,60 36.96,61.47 9.14,61.47 8.51,60.83 6.98,60.83 6.6,60.45 6.6,58.42 CN2.24
GP23: length 33.6
  Top Layer w0.203: R39.1 51.75,36.15 51.75,39.56 35.78,55.53 U5.35
GP24: length 31.6
  Top Layer w0.203: R40.1 53.93,38.01 36.02,55.93 U5.36
GP25: length 86.3
  Top Layer w0.203: v3(19.81,76.2) 16.51,76.2 10.41,82.3 10.41,84.61 10.41,84.62 ; U5.37 36.25,56.33 38.99,53.59 v3(40.39,53.59)
  Bottom Layer w0.203: v3(19.81,76.2) 28.6,84.99 44.55,84.99 44.96,84.58 44.96,58.17 v3(40.39,53.59)
GP26: length 51.5
  Top Layer w0.203: v3(37.47,56.01) 36.74,56.73 U5.38
  Bottom Layer w0.203: v3(37.47,56.01) 38.02,56.57 38.02,59.26 36.32,60.96 10.8,60.96 8.25,58.42 7.24,58.42 6.48,57.66 6.48,56.39 5.92,55.83 4.65,55.83 4.06,55.25 4.06,53.34 CN2.20
GP27: length 50.3
  Top Layer w0.203: U5.39 37.23,57.13 v3(37.47,56.9)
  Bottom Layer w0.203: v3(37.47,56.9) 37.47,58.67 36.07,60.07 19.97,60.07 18.09,58.19 18.09,56.06 17.68,55.65 17.68,50.7 15.37,48.39 6.48,48.39 CN2.18
GP28: length 71
  Top Layer w0.203: U5.40 37.97,57.53 44.96,50.55 v3(44.96,48.51)
  Bottom Layer w0.203: CN2.14 4.19,44.45 3.94,44.2 3.94,38.99 4.83,38.1 34.54,38.1 v3(44.96,48.51)
GP29: length 67
  Top Layer w0.203: v3(46.23,48.51) 46.23,50.55 38.84,57.93 U5.41
  Bottom Layer w0.203: CN2.8 6.73,35.43 9.02,35.43 11.3,37.72 35.43,37.72 v3(46.23,48.51)
HSYNC: length 19.7
  Top Layer w0.203: R39.2 59.9,30 65,30 67.56,27.43 67.56,23.52 66.54,22.5
L-PWR: length 13.2
  Top Layer w0.305: U9.6 54.6,59.17 54.36,58.93 54.36,56.64 R44.2
  Top Layer w0.762: C40.1 55.09,55.91 R44.2 ; C40.1 C46.2 ; C40.1 58.57,54 L4.1
R-PWR: length 13.3
  Top Layer w0.305: R45.2 54.36,76.14 54.36,78.86 54.68,79.17 U8.6
  Top Layer w0.762: R45.2 54.5,74.09 C41.1 C47.2 55.09,68.13 L5.1
RUN: length 177.6
  Top Layer w0.203: SW3.1 73.25,21.69 67.06,15.5 45.47,15.5 ; 45.47,15.5 45.47,33.74 29.51,49.7 U5.26 ; 45.47,15.5 27.69,15.5 23.75,11.56 13.33,11.56 7.37,17.53 7.37,23.62 v3(1.91,29.08)
  Bottom Layer w0.203: CN2.22 6.73,53.21 6.73,51.44 6.1,50.8 4.7,50.8 1.91,48.01 v3(1.91,29.08)
SD-VCC: length 10.4
  Top Layer w0.61: R29.2 21,18.09 20.46,17.55 C15.1 14.85,16 CARD2.4
USB-DM: length 40.7
  Top Layer w0.203: U7.6 40.4,75.17 41.1,74.47 47.96,74.47 v3(48.01,74.42) ; 65.97,87.25 USB2.B7 ; 65.97,87.25 65.66,87.25 v3(65.53,87.12) ; 65.97,87.25 66.02,87.3 66.02,88.02 66.25,88.25 USB2.A7
  Bottom Layer w0.203: v3(65.53,87.12) 64.26,88.39 60.07,88.39 49.02,77.35 49.02,74.68 48.77,74.42 v3(48.01,74.42)
USB-DP: length 41.9
  Top Layer w0.203: U7.5 40.4,76.44 41.1,75.74 47.96,75.74 v3(48.01,75.69) ; 68.25,87.75 USB2.A6 ; 68.25,87.75 68.25,88.5 68,88.75 USB2.B6 ; 68.25,87.75 68.33,87.83 v3(68.33,87.88)
  Bottom Layer w0.203: v3(48.01,75.69) 48.01,76.83 59.94,88.77 67.44,88.77 v3(68.33,87.88)
VSYNC: length 24
  Top Layer w0.203: R40.2 56.41,36.55 61.96,31 64.88,31 68.07,27.81 68.07,21.74 66.54,20.21
$1N16226: length 7.1
  Top Layer w0.203: 61.46,24.79 60.89,24.22 R38.2 56.5,24.27 R15.2
$1N16303: length 5
  Top Layer w0.203: R13.2 61.44,22.48 61.46,22.5
$1N16324: length 5.3
  Top Layer w0.203: 61.46,27.08 60.56,27.98 R14.2
$1N17160: length 17.9
  Top Layer w0.203: 30.83,66.5 32.29,66.5 32.73,66.06 32.73,65.16 32.19,64.62 25.63,64.62 25.3,64.29 24.92,64.29 24.28,63.65 24.28,61.95 24.74,61.49 25.5,61.49 26.71,60.29 U5.52
$1N17190: length 19.3
  Top Layer w0.203: U5.51 27.11,60.39 25.65,61.85 24.89,61.85 24.64,62.1 24.64,63.41 25.16,63.93 25.45,63.93 25.78,64.26 32.34,64.26 33.09,65.01 33.09,67.16 32.5,67.75 30.86,67.75
$1N17220: length 10.9
  Top Layer w0.203: 24.83,66.75 23.5,66.75 22.73,65.98 22.73,62.36 24.31,60.78 25.12,60.78 25.91,59.99 U5.54
$1N17286: length 12.1
  Top Layer w0.203: 24.56,67.75 23,67.75 22.38,67.13 22.38,62.2 24.16,60.43 24.97,60.43 25.51,59.89 U5.55
$1N17350: length 18.2
  Top Layer w0.203: R23.1 24.18,69.11 ; U5.56 25.03,59.2 24.74,59.2 21.46,62.48 21.46,69 24,69
$1N17556: length 13.9
  Top Layer w0.203: U5.53 26.31,60.1 25.27,61.14 24.59,61.14 23.93,61.8 23.93,63.79 24.78,64.64 25.15,64.64 25.75,65.25 31.19,65.25 U6.5
$1N17761: length 6.3
  Top Layer w0.203: R5.2 27.53,47.25 27,47.25 26.5,47.75 26.5,50 27.51,51.01 U5.21
$1N17798: length 4.9
  Top Layer w0.203: R5.1 27.44,45.64 X1.1 26.51,45.18 C4.2
$1N18648: length 17.1
  Top Layer w0.203: C3.2 29.53,43.32 X1.3 27.86,41.66 26.16,41.66 25.15,42.67 25.15,45.21 26.14,46.21 26.14,47.6 ; U5.20 27.11,51.24 26.14,50.27 26.14,47.6 ; 26.14,47.6 26.16,47.59
$1N25166: length 5
  Top Layer w0.203: R3.2 3.93,84.62 LED1.2
$1N89274: length 1.9
  Top Layer w0.203: USB2.B5 66.32,89.75 R31.2
$1N89558: length 1.9
  Top Layer w0.203: R32.2 66.32,86.75 USB2.A5
$1N90266: length 19.3
  Top Layer w0.203: USB2.1 67.56,83.5 R33.2
  Top Layer w0.61: USB2.2 USB2.4 72.39,91.84 72.39,84.16 USB2.3 USB2.1
$1N123261: length 8.2
  Top Layer w0.203: R34.2 27.22,88.33 27.35,88.21 ; R34.2 25.07,91.56 C28.2 ; R34.2 27.91,91.56 C30.1
$1N123370: length 7.9
  Top Layer w0.203: C29.2 16.6,91.7 R35.2 ; R35.2 18.52,88.49 L2.1 ; R35.2 19,91.7 C31.1
$1N149316: length 13.6
  Top Layer w0.203: 41.66,31.59 40.98,30.91 28.43,30.91 U12.14
$1N153099: length 51.2
  Top Layer w0.203: C32.2 25.67,77.72 15.9,77.72 12.45,81.18 12.45,84.33 10.01,86.77 8.99,86.77 7.11,88.65 7.11,92.46 7.62,92.96 8.84,92.96 CN3.2 ; C32.2 R42.1 30,80.56 ; C32.2 27.95,82.61 27.35,83.21 28.71,83.21 30.75,85.25 30.75,90.07 C30.2
$1N153113: length 42.5
  Top Layer w0.203: L2.2 21.25,80.74 R43.1 ; L2.2 22.25,87.22 22.25,90.05 C31.2 ; L2.2 17.8,82.78 C33.2 16.52,80 13.97,82.55 13.97,90.17 9.91,94.23 6.1,94.23 5.44,93.58 CN3.3
$1N153138: length 21.5
  Top Layer w0.203: R42.2 32,87.25 33.65,88.9 43.6,88.9 VR1.5
$1N153144: length 48.4
  Top Layer w0.203: R43.2 23.25,93.86 24.76,95.38 43.12,95.38 46.5,92 46.5,87.14 45.59,86.23 44.27,86.23 VR1.3
$1N153495: length 5.2
  Top Layer w0.203: 52.96,62.5 52.58,62.12 52.58,58.73 52.38,58.53 U9.4
$1N153498: length 3.4
  Top Layer w0.203: C50.2 48.21,59.17 U9.3
$1N153501: length 5.8
  Top Layer w0.203: U8.4 51.38,78.5 52.38,78.5 52.58,78.7 52.58,82.62 52.96,83
$1N153504: length 2.9
  Top Layer w0.203: U8.3 48.71,79.17 48.53,79
$1N153560: length 12.5
  Top Layer w0.203: VR1.2 41,83.97 41.38,83.59 41.38,82.83 41.78,82.42 43.31,82.42 44.7,81.03 44.7,79.76 45.21,79.25 C49.1 ; 46.47,79.39 46.47,79
$1N153940: length 12.5
  Top Layer w0.203: U9.1 51.15,60.68 51.15,63.09 51.56,63.5 53.3,63.5 53.5,63.3 53.5,57.5 R44.1
$1N153979: length 13.9
  Top Layer w0.203: R45.1 53.5,77 53.5,83.79 53.21,84.07 51.69,84.07 51.35,83.74 U8.1
$1N154156: length 4.8
  Top Layer w0.355: L9.1 59.06,80.47 U8.8
$1N154158: length 5.2
  Top Layer w0.355: U8.5 58.01,78.53 L8.1
$1N154330: length 14.9
  Top Layer w0.355: U9.8 55.65,65.81 57.5,67.66 57.5,71.5 59,73 L7.1
$1N154332: length 16.5
  Top Layer w0.355: U9.5 55.67,58.5 57.23,58.5 57.91,59.18 57.91,60.96 60.45,63.5 61.47,63.5 61.98,64.01 61.98,66.8 60.03,68.74 L6.1
$1N157558: length 89.5
  Top Layer w0.203: 20.23,69.25 23.88,72.9 33.02,72.9 42.42,63.5 42.42,57.78 50.67,49.53 57.15,49.53 60.13,52.51 60.13,57.47 59.18,58.42 59.18,61.47 60.2,62.48 61.21,62.48 62.48,63.75 v1(64.01,63.75)
  Bottom Layer w0.203: SW4.1 73.25,50.19 66.5,56.95 66.5,63.25 65.99,63.75 v1(64.01,63.75)
$1N158121: length 35.7
  Top Layer w0.203: C50.1 48.77,61.8 48.77,75.95 47.68,77.03 45.97,77.03 44.25,78.75 44.25,80.97 43.17,82.06 41.51,82.06 41.02,82.55 41.02,83.44 40.17,84.29 40.17,84.33 40.13,84.33 39,85.46 VR1.4
$1N161504: length 11.1
  Top Layer w0.355: U11.1 67.68,72.27 66.04,73.91 62.88,73.91 L7.2
$1N161517: length 10.2
  Top Layer w0.355: U11.2 71.91,69.64 62.32,69.64 L6.2
$1N161532: length 11.8
  Top Layer w0.355: U10.1 67.31,79.27 ; 67.31,79.27 67.29,79.27 67.29,80.01 ; 67.31,79.27 67.31,79.99 67.29,80.01 ; 67.31,79.27 67.31,79.25 ; 67.29,80.01 62.48,80.01 L9.2
$1N161537: length 11.8
  Top Layer w0.355: 67.43,75.95 62.51,75.95 L8.2 ; 67.43,75.95 67.43,76.73 U10.2 ; 67.43,75.95 67.31,76.07
  Top Layer w0.508: 67.31,76.71 67.31,76.07
$1N169673: length 20.3
  Top Layer w0.203: USB5.3 65.25,61.25 63.28,61.25 62.23,60.2 62.23,53.97 57.02,48.77 R37.1
$1N169674: length 40.8
  Top Layer w0.203: U5.47 28.71,60.96 29.14,61.39 29.14,63.51 29.35,63.71 32.29,63.71 33.44,64.87 33.44,65.69 34.43,66.67 38.48,66.67 41.24,63.91 41.24,57.56 50.05,48.75 50.07,48.77 R37.2
$1N169680: length 19.3
  Top Layer w0.203: R36.1 56.01,46.99 63.37,54.36 63.37,58.62 64.8,60.05 USB5.2
$1N169681: length 40.9
  Top Layer w0.203: R36.2 50.8,46.99 40.75,57.04 40.75,63.77 38.23,66.29 34.67,66.29 33.8,65.42 33.8,64.66 32.49,63.35 29.59,63.35 29.5,63.27 29.5,60.75 29.11,60.36 U5.46

## Copper pours and planes (outline as drawn; the poured copper is in the pictures)
GND on Bottom Layer: 75.1,-0.06 0.1,-0.06 0.1,99.94 75.1,99.94

## Text on the board
Bottom Silkscreen Layer: BOOT | RESET | GP0 ,5V | GP15,GP16 | GP14,GP17 | GND ,GND | GP13,GP18 | GP12,GP19 | GP11,GP20 | GP10,GP21 | GP9 ,GP22 | GP8  ,RUN | GP7 ,G26 | GP6 ,GP28 | GP4 ,3V3 | GP3 ,3V3 | GP2 ,GP29 | GP1 ,5V | GP6 ,GP27 | L- | L+ | R- | R+ | Configuration: Enter in this order / OPTION PICO OFF / OPTION SYSTEM I2C GP14,GP15 / OPTION SDCARD GP13, GP10, GP11, GP12 / OPTION KEYBOARD UK/US/BE/ES/FR/GR / OPTION RTC AUTO (optional) / OPTION VGA PINS GP23,GP18 / OPTION AUDIO GP16,GP17
Top Silkscreen Layer: PicoMiteVGA / USB Edition V1.0 / PCB Peter Mather / MMBasic Geoff Graham / & Peter Mather | GP16,GP15 | GP17,GP14 | GND ,GND | GP18,GP13 | GP19,GP12 | GP20,GP11 | GP21,GP10 | GP22,GP9 | RUN ,GP8 | GP26,GP7 | GP27,GP6 | GP28,GP5 | 3V3 ,GP4 | 3V3 ,GP3 | GP29,GP2 | GND,GND | 5V ,GP1 | 5V ,GP0 | CR2032 | AMP | RESET | BOOT
